# Altium project Peggy Tracker.PrjPcb
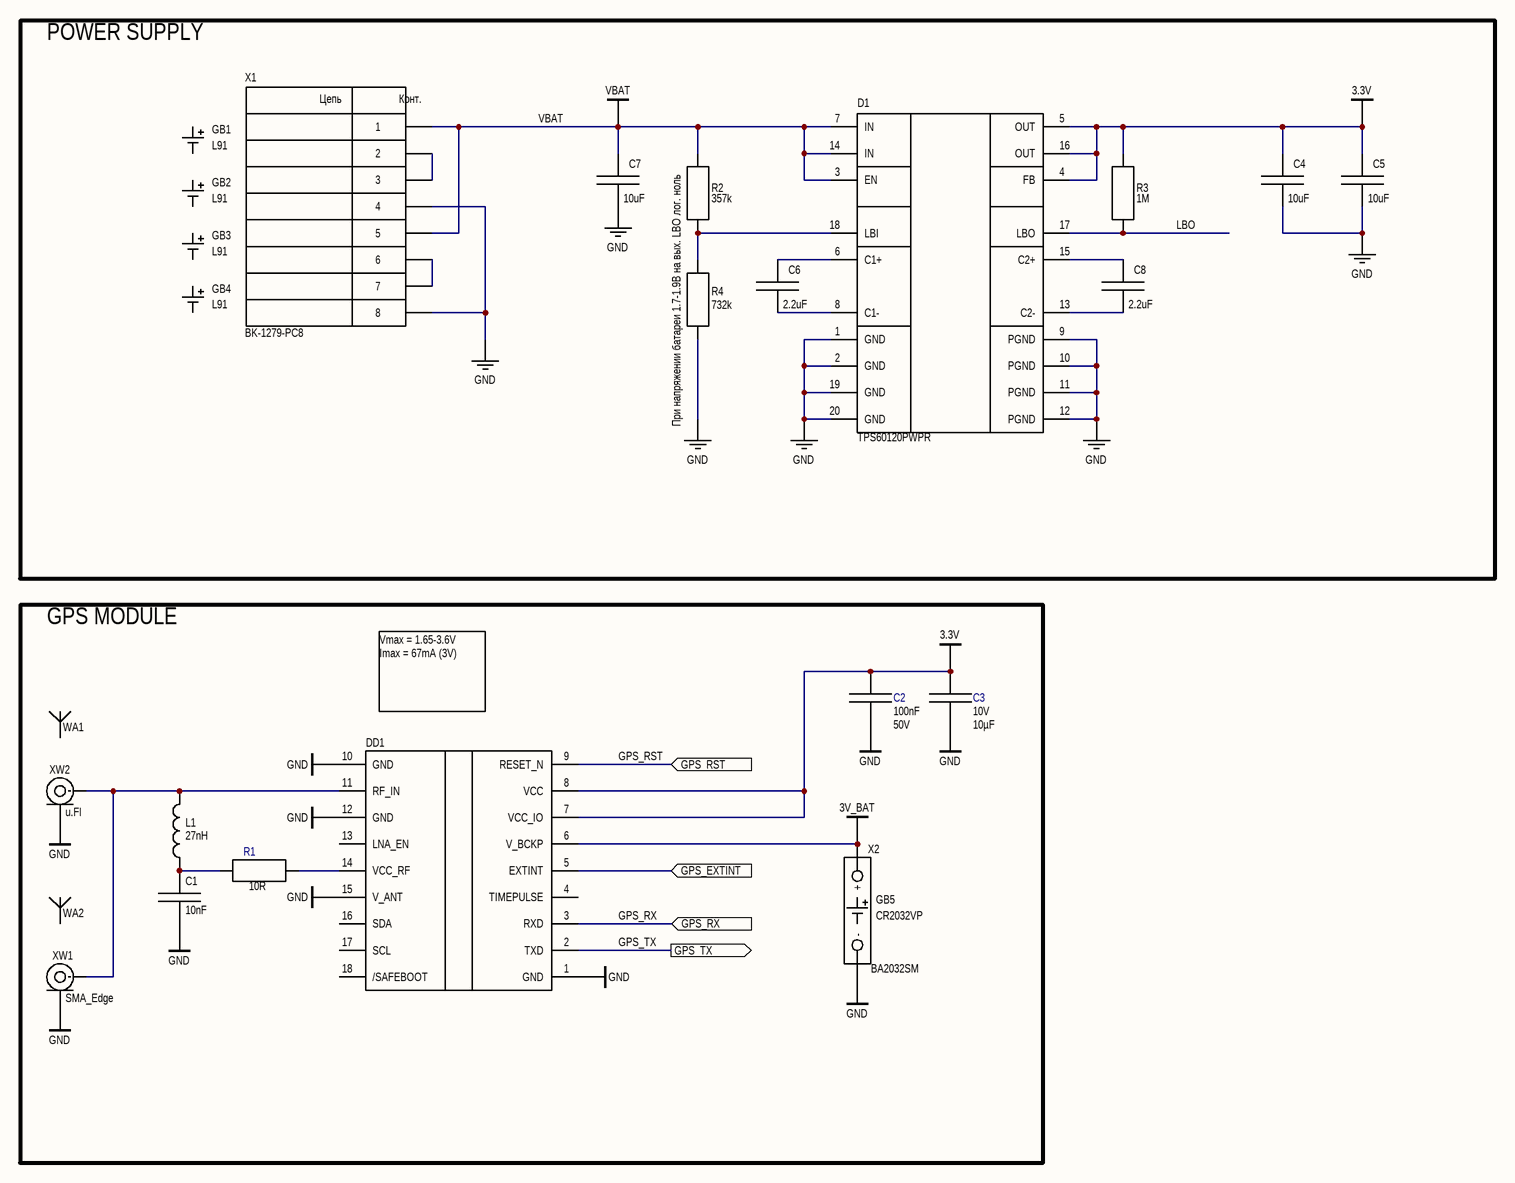
[diagram p0: Схема питания и GPS Peggy Tracker.SchDoc]
CAGE_CODE: ?????; CONTRACT_NUMBER: <CONTRACT NO>; DOC_NO_ASSY_DWG: <ASSY DWG NO>; DOC_NO_BOM: <BOM DOC NO>; DOC_NO_FAB_DWG: <FAB DWG NO>; DOC_NO_SCH_DWG: <SCH DWG NO>; PCB_2_DEC_TOL: +/-.01; PCB_3_DEC_TOL: +/-.010; PCB_ANG_TOL: +/-1/2; PCB_ASSEMBLY_NO: <PCB ASSY NO>; PCB_CHECKER: - -----; PCB_CHECKER_APP_DATE: --/--/----; PCB_DESIGNER: - -----; PCB_DESIGNER_APP_DATE: --/--/----; PCB_DWG_NO: <PCB DWG NO>; PCB_ENGINEER: - -----; PCB_ENGINEER_APP_DATE: --/--/----; PCB_PART_NUMBER: <PCB PN>; PCB_REV: A; SCH_REV: A
2 sheets, 64 parts. Net scope: flat (ports and power ports of the same name join across sheets).
Board file: Печатная плата Peggy Tracker.PcbDoc
Sheets:
  Схема питания и GPS Peggy Tracker.SchDoc
  Схема блока МК Peggy Tracker.SchDoc

## Sheet Схема питания и GPS Peggy Tracker.SchDoc
size 420 x 297 mm; ENG_APP_DATE: --/--/--; DSN_APP_DATE: --/--/--; CHK_APP_DATE: --/--/--; Scale: 1:1; Разраб.: Иванов; Обозначение документа: АБВГ.123456.001 Э3; Пров.: Петров; Утв.: Сидоров; Наименование организации: ОАО "Ваша фирма"; Перв. применение: АБВГ.123456.000; Наименование изделия 1: Плата; Наименование изделия 2: Схема электрическая; Наименование изделия 3: принципиальная; Нач. отд.: Нач. отд.; Фамилия нач. отд.: Сидоров

### Parts
C1  10nF  [CH0603C]
C2  value 100nF  Voltage Rating: 50V  [CAPC1608X09N]  (hidden comment: GCM188R71H104KA57D)
C3  Voltage Rating: 10V  Capacitance: 10µF  [CAPC2013X135X45NL10T25]  (hidden comment: CL21Y106KPQVPNE)
C4  10uF  [CH1206C]
C5  10uF  [CH1206C]
C6  2.2uF  [CH0805C]
C7  10uF  [CH1206C]
C8  2.2uF  [CH0805C]
D1  TPS60120PWPR  [20-TSSOP (PAD)]
DD1  MAX-M8C-0  [MOD: MAX-M8C-0]  (value not drawn)
GB1  L91
GB2  L91
GB3  L91
GB4  L91
GB5  CR2032VP
L1  27nH  [CH0603L]
R1  10R  [CH0603R]
R2  357k  [CH0603R]
R3  1M  [CH0603R]
R4  732k  [CH0603R]
WA1  CRJKS0010-LNA-G65U  (value not drawn)
WA2  MIKE3A/3M/SMAM/S/S/17  (value not drawn)
X1  BK-1279-PC8  [CON: BK-1279-PC8]
X2  BA2032SM  [CON: BA2032SM]
XW1  SMA_Edge  [CON: SMA - Edge]
XW2  u.Fl  [CON: u.Fl]

### Blocks framed on the sheet
POWER SUPPLY: C4-C8 D1 GB1-GB4 R2-R4 X1
GPS MODULE: C1-C3 DD1 GB5 L1 R1 WA1 WA2 X2 XW1 XW2

### Ports
GPS_EXTINT (in), GPS_RST (in), GPS_RX (in), GPS_TX (out)

### Nets
3.3V: C2.1 C3.2 C4.1 C5.1 D1.4(FB) D1.5(OUT) D1.16(OUT) DD1.7(VCC_IO) DD1.8(VCC) R3.2
3V_BAT: DD1.6(V_BCKP) X2.1(+)
GND: C1.2 C2.2 C3.1 C4.2 C5.2 C7.2 D1.1(GND) D1.2(GND) D1.9(PGND) D1.10(PGND) D1.11(PGND) D1.12(PGND) D1.19(GND) D1.20(GND) DD1.1(GND) DD1.10(GND) DD1.12(GND) DD1.15(V_ANT) R4.1 X1.4 X1.8 X2.2(-) XW1.2(IN) XW2.2(IN)
VBAT: C7.1 D1.3(EN) D1.7(IN) D1.14(IN) R2.2 X1.1 X1.5
GPS_RST: DD1.9(RESET_N) ; port GPS_RST
GPS_RX: DD1.3(RXD) ; port GPS_RX
GPS_TX: DD1.2(TXD) ; port GPS_TX
LBO: D1.17(LBO) R3.1
NetC1_1: C1.1 L1.1 R1.1
NetC6_1: C6.1 D1.6(C1+)
NetC6_2: C6.2 D1.8(C1-)
NetC8_1: C8.1 D1.15(C2+)
NetC8_2: C8.2 D1.13(C2-)
NetD1_18: D1.18(LBI) R2.1 R4.2
NetDD1_5: DD1.5(EXTINT) ; port GPS_EXTINT
NetDD1_11: DD1.11(RF_IN) L1.2 XW1.1(IN) XW2.1(IN)
NetDD1_14: DD1.14(VCC_RF) R1.2
NetX1_2: X1.2 X1.3
NetX1_6: X1.6 X1.7

Not connected (* = marked no-connect by the designer): DD1 4(TIMEPULSE) 13(LNA_EN) 16(SDA) 17(SCL) 18(/SAFEBOOT); GB1 1(+) 2(-); GB2 1(+) 2(-); GB3 1(+) 2(-); GB4 1(+) 2(-); GB5 1(+) 2(-); WA1 1; WA2 1

### Notes on the sheet
- При напряжении батареи 1.7-1.9В на вых. LBO лог. ноль
- (near DD1) Vmax = 1.65-3.6V
  Imax = 67mA (3V)
- Перв. примен.
- Справ. №
- Подп. и дата
- Инв. № дубл.
- Взам. инв. №
- Разраб.
- Изм.
- Лист
- № докум.
- Подп.
- Дата
- Лит.
- Масса
- Масштаб
- Пров.
- Т.контр.
- Листов
- Инв. № подл.
- Утв.
- Н.контр.
- Копировал
- Формат А3
- (in symbol 8-Connector) Цепь; Конт.

### Library data of the parts
C1 = Capacitor: CAP CER 10000PF 50V X7R 0603; Manufacturer: Murata Electronics; Model: GCM188R71H103KA37D; HelpURL: https://www.digikey.com/en/products/detail/murata-electronics/GCM188R71H103KA37D/1641652?s=N4IgTCBcDaIOIGECyBGAHGgSgdhQCRQAYBmAaQEFjsAREAXQF8g; ComponentKind: 0603 (1608 Metric); Value: 10nF; Supplier 1: Digi-Key; Supplier Part Number 1: 490-4778-1-ND
C2 = CMP-001-00128-5: CAP CER 0.1UF 50V X7R 0603; Manufacturer: Murata; Tolerance: 10%; Approvals: CSA,UR; Color: Grey; RoHS Compliant: Yes; Case/Package: 0603; Max Operating Temperature: 125°C; Min Operating Temperature: -55°C; Case Code (Metric): 1608; Depth: 0.8mm; Dielectric: X7R; Height: 0.8mm; Length: 1.6mm; Mount: Surface Mount; Package Quantity: 1; Packaging: Tape and Reel; Radiation Hardening: No; Series: GCM; Termination: SMD/SMT; Thickness: 0.035inch; Width: 0.031inch; Manufacturer Part Number: GCM188R71H104KA57D; Lead Free: Lead Free; REACH SVHC: No SVHC; Voltage: 50V; ComponentLink1Description: https://datasheet.ciiva.com/16624/product-16624562.pdf?src-supplier=Avnet+Europe; ComponentLink1URL: https://datasheet.ciiva.com/16624/product-16624562.pdf?src-supplier=Avnet+Europe; ComponentLink2Description: https://datasheet.ciiva.com/133/product-133574.pdf?src-supplier=Digi-Key; ComponentLink2URL: https://datasheet.ciiva.com/133/product-133574.pdf?src-supplier=Digi-Key; ComponentLink3Description: https://datasheet.ciiva.com/133/product-133575.pdf?src-supplier=Digi-Key; ComponentLink3URL: https://datasheet.ciiva.com/133/product-133575.pdf?src-supplier=Digi-Key; ComponentLink4Description: https://datasheet.ciiva.com/18183/getdatasheetpartid-98693-18183626.pdf?src-supplier=Verical; ComponentLink4URL: https://datasheet.ciiva.com/18183/getdatasheetpartid-98693-18183626.pdf?src-supplier=Verical; ComponentLink5Description: https://datasheet.ciiva.com/11786/0900766b80ef92d0-11786863.pdf?src-supplier=RSComponents; ComponentLink5URL: https://datasheet.ciiva.com/11786/0900766b80ef92d0-11786863.pdf?src-supplier=RSComponents; ComponentLink6Description: https://datasheet.ciiva.com/133/product-133573.pdf?src-supplier=Digi-Key; ComponentLink6URL: https://datasheet.ciiva.com/133/product-133573.pdf?src-supplier=Digi-Key; ComponentLink7Description: https://datasheet.ciiva.com/2989/product-2989242.pdf?src-supplier=Avnet; ComponentLink7URL: https://datasheet.ciiva.com/2989/product-2989242.pdf?src-supplier=Avnet; ComponentLink8Description: https://datasheet.ciiva.com/16497/product-16497247.pdf?src-supplier=Future+Electronics; ComponentLink8URL: https://datasheet.ciiva.com/16497/product-16497247.pdf?src-supplier=Future+Electronics; Construction: Flat; Design Item ID: 1_16; Pricing 1: 1=0,11000, 10=0,07900, 50=0,04280, 100=0,03500, 500=0,02502, 1000=0,01966 (USD); Ratings: AEC-Q200; RoHS: Yes; Source: Meteo_1.SCHLIB; Stock 1: 4755830; Voltage Rating (DC): 50V
C3 = CMP-001-00143-4: CAP CER 10UF 10V X7S 0805; Manufacturer: Samsung; Value: 10µF; Tolerance: 10%; Manufacturer Part Number: CL21Y106KPQVPNE; Packaging: Tape and Reel; Max Operating Temperature: 125°C; RoHS Compliant: Yes; Case/Package: 0805; Features: Soft Termination; Case Code (Imperial): 0805; Thickness: 0.055inch; Length: 0.079inch; Min Operating Temperature: -55°C; Width: 0.049inch; Ratings: AEC-Q200; Mount: Surface Mount; Case Code (Metric): 2012; Lead Free: Lead Free
C4 C5 C7 = Capacitor: Cap Ceramic 10uF 16V X7R 20% SMD 1206 125°C Embossed T/R; Manufacturer: Samsung Electro-Mechanics; Model: CL31B106MOHNNNE; HelpURL: https://www.digikey.com/en/products/detail/samsung-electro-mechanics/CL31B106MOHNNNE/5961125; ComponentKind: 1206 (3216 Metric); Value: 10uF; Supplier 1: Digi-Key; Supplier Part Number 1: 1276-6641-1-ND; Manufacturer Part Number: CL31B106MOHNNNE; RoHS: Yes; Category: Ceramic Capacitors; Stock: 1126; Pricing: 1=0,22000, 10=0,15000, 50=0,09000, 100=0,07600, 500=0,05202, 1000=0,04602 (USD); Mount: Surface Mount; Case/Package: 1206; Case Code (Metric): 3216; Case Code (Imperial): 1206; Min Operating Temperature: -55°C; Max Operating Temperature: 125°C; Capacitance: 10uF; Tolerance: 20%; Dielectric: X7R; Voltage Rating (DC): 16V; Packaging: Tape and Reel; Voltage Rating: 16V; Length: 0.126inch; Width: 0.063inch; Thickness: 0.071inch; RoHS Compliant: Yes; ComponentLink1URL: http://www.samsungsem.com/kr/support/product-search/mlcc/CL31B106MOHNNNE.jsp?src-supplier=Digi-Key; ComponentLink1Description: http://www.samsungsem.com/kr/support/product-search/mlcc/CL31B106MOHNNNE.jsp?src-supplier=Digi-Key
C6 C8 = Capacitor: Cap Ceramic 10uF 16V X7R 20% SMD 1206 125°C Embossed T/R; Manufacturer: Murata Electronics; Manufacturer Part Number: CL31B106MOHNNNE; Model: GRM21BR71E225KE11L; Voltage Rating: 25V; HelpURL: https://www.digikey.com/en/products/detail/murata-electronics/GRM21BR71E225KE11L/6606096; ComponentKind: 0805 (2012 Metric); Value: 2.2uF; RoHS: Yes; Category: Ceramic Capacitors; Stock: 1126; Pricing: 1=0,22000, 10=0,15000, 50=0,09000, 100=0,07600, 500=0,05202, 1000=0,04602 (USD); Mount: Surface Mount; Case/Package: 0805; Case Code (Metric): 3216; Min Operating Temperature: -55°C; Max Operating Temperature: 125°C; Capacitance: 2.2uF; Tolerance: 20%; Dielectric: X7R; Voltage Rating (DC): 16V; Packaging: Tape and Reel; Length: 0.126inch; Width: 0.063inch; Thickness: 0.071inch; RoHS Compliant: Yes; ComponentLink1URL: http://www.samsungsem.com/kr/support/product-search/mlcc/CL31B106MOHNNNE.jsp?src-supplier=Digi-Key; ComponentLink1Description: http://www.samsungsem.com/kr/support/product-search/mlcc/CL31B106MOHNNNE.jsp?src-supplier=Digi-Key; Supplier 1: Digi-Key; Supplier Part Number 1: 490-14467-1-ND
D1 = TPS60120PWPR: Charge Pump Switching Regulator 3.3V; Manufacturer: Texas Instruments; Model: TPS60120PWPR; HelpURL: https://www.digikey.com/en/products/detail/texas-instruments/TPS60120PWPR/1671965; ComponentKind: PowerTSSOP; Supplier 1: Digi-Key; Supplier Part Number 1: 296-48756-1-ND
DD1 = MAX-M8C-0: RF RCVR GNSS/GPS 1.575GHZ 18LCC; Manufacturer: U-Blox; Model: MAX-M8C-0; ComponentKind: Surface Mount; HelpURL: https://www.digikey.com/en/products/detail/u-blox/MAX-M8C-0/6150635?s=N4IgTCBcDaILIEEAaBaOAOAwigDCAugL5A; Supplier 1: Digi-Key; Supplier Part Number 1: 672-MAX-M8C-0CT-ND
GB1-GB5 = Battery_1CELL: Manufacturer: Energizer Battery Company; Supplier 1: Digi-Key
  GB1-GB4: Model: L91; HelpURL: https://www.digikey.com/en/products/detail/energizer-battery-company/L91/704843?s=N4IgjCBcpgnAHLKoDGUBmBDANgZwKYA0IA9lANogAMIAugL7EC0ATMiGpAC4BOArkVIUQAVjr1GINpEoAZWGAAEAUQB2%2BHgHMAlgC8NisADoRANTrEx0EAAcoYYjbuQwVKhKA; ComponentKind: AA; Supplier Part Number 1: N602-ND
  GB5: Model: CR2032VP; HelpURL: https://www.digikey.com/en/products/detail/energizer-battery-company/CR2032VP/704858?s=N4IgTCBcDaIMICUwAYDMYBqAFEBdAvkA; ComponentKind: Coin, 20.0mm; Supplier Part Number 1: N189-ND
L1 = Inductor: Manufacturer: Murata Electronics; Model: LQW18AN27NJ00D; HelpURL: https://www.digikey.com/en/products/detail/murata-electronics/LQW18AN27NJ00D/584382?s=N4IgTCBcDaIDIEUDqBGAHAQQHJgOxYCkAGIgERAF0BfIA; ComponentKind: 0603 (1608 Metric); Value: 27nH; Supplier 1: Digi-Key; Supplier Part Number 1: 490-1174-1-ND
R1 = Resistor: RES 10 OHM 5% 1/3W 0603; Manufacturer: KOA Speer Electronics, Inc.; Model: SG73P1JTTD100J; HelpURL: https://www.digikey.com/en/products/detail/koa-speer-electronics-inc/SG73P1JTTD100J/10187128?s=N4IgTCBcDaIMoHEDsBmACgRgFIBUcBEMAGIrEAXQF8g; ComponentKind: 0603 (1608 Metric); Value: 10R; Supplier 1: Digi-Key; Supplier Part Number 1: 2019-SG73P1JTTD100JCT-ND
R2 = Resistor: Manufacturer: YAGEO; Model: RC0603FR-07357KL; HelpURL: https://www.digikey.com/en/products/detail/yageo/RC0603FR-07357KL/727177*; ComponentKind: 0603 (1608 Metric); Value: 357k; Supplier 1: Digi-Key; Supplier Part Number 1: 311-357KHRCT-ND
R3 = Resistor: Manufacturer: YAGEO; Model: RC0603FR-071ML; HelpURL: https://www.digikey.com/en/products/detail/yageo/RC0603FR-071ML/726844; ComponentKind: 0603 (1608 Metric); Value: 1M; Supplier 1: Digi-Key; Supplier Part Number 1: 311-1.00MHRCT-ND
R4 = Resistor: Manufacturer: YAGEO; Model: RC0603FR-07732KL; HelpURL: https://www.digikey.com/en/products/detail/yageo/RC0603FR-07732KL/727376; ComponentKind: 0603 (1608 Metric); Value: 732k; Supplier 1: Digi-Key; Supplier Part Number 1: 311-732KHRCT-ND
WA1 = Antenna 1pin: 1.583GHz GPS Ceramic Patch RF Antenna 1.559GHz ~ 1.610GHz 17dBi - -; Manufacturer: NimbeLink, LLC; Model: CRJKS0010-LNA-G65U; HelpURL: https://www.digikey.com/en/products/detail/nimbelink-llc/CRJKS0010-LNA-G65U/15519589; ComponentKind: *; Supplier 1: Digi-Key; Supplier Part Number 1: 1477-CRJKS0010-LNA-G65U-ND
WA2 = Antenna 1pin: 1.575GHz GPS Module RF Antenna - 28dB SMA Male Adhesive, Magnetic; Manufacturer: Siretta Ltd; Model: MIKE3A/3M/SMAM/S/S/17; HelpURL: https://www.digikey.com/en/products/detail/siretta-ltd/MIKE3A-3M-SMAM-S-S-17/6096367; ComponentKind: SMA Male; Supplier 1: Digi-Key; Supplier Part Number 1: MIKE3A/3M/SMAM/S/S/17-ND
X1 = 8-Connector: BATTERY HOLDER AA 4 CELL PC PIN; Manufacturer: MPD (Memory Protection Devices); Model: BK-1279-PC8; HelpURL: https://www.digikey.com/en/products/detail/mpd-memory-protection-devices/BK-1279-PC8/1640077; ComponentKind: PC Pin; Supplier 1: Digi-Key; Supplier Part Number 1: BK-1279-PC8-ND
X2 = Holder_1Cell: Manufacturer: MPD (Memory Protection Devices); Model: BA2032SM; HelpURL: https://www.digikey.com/en/products/detail/mpd-memory-protection-devices/BA2032SM/257743?s=N4IgTCBcDaIEIEEwAYDMYDKBZEBdAvkA; ComponentKind: 20.0mm 1 Cell SMD (SMT) Tab; Supplier 1: Digi-Key; Supplier Part Number 1: BA2032-ND
XW1 = SMA: RF; Manufacturer: Molex; Model: 0732512120; HelpURL: https://www.digikey.com/en/products/detail/molex/0732512120/1465158?s=N4IgTCBcDaIOwGYwFYCMBaMqwAYQF0BfIA; ComponentKind: Board Edge; Supplier 1: Digi-Key; Supplier Part Number 1: WM5536-ND
XW2 = u.Fl: RF; Manufacturer: Hirose Electric Co Ltd; Model: CONUFL001-SMD-T; HelpURL: https://www.digikey.com/en/products/detail/linx-technologies-inc/CONUFL001-SMD-T/7427732?s=N4IgTCBcDaIMIHkByBVAYgGQAxYIwFoBlAWQBF8AVEAXQF8g; ComponentKind: Surface Mount Solder; Supplier 1: Digi-Key; Supplier Part Number 1: CONUFL001-SMD-TCT-ND

## Sheet Схема блока МК Peggy Tracker.SchDoc
size 420 x 297 mm; Address1: Address1; Address2: Address2; Address3: Address3; Address4: Address4; SheetNumber: 1; Scale: 1:1; Обозначение документа: АБВГ.123456.001 Э3
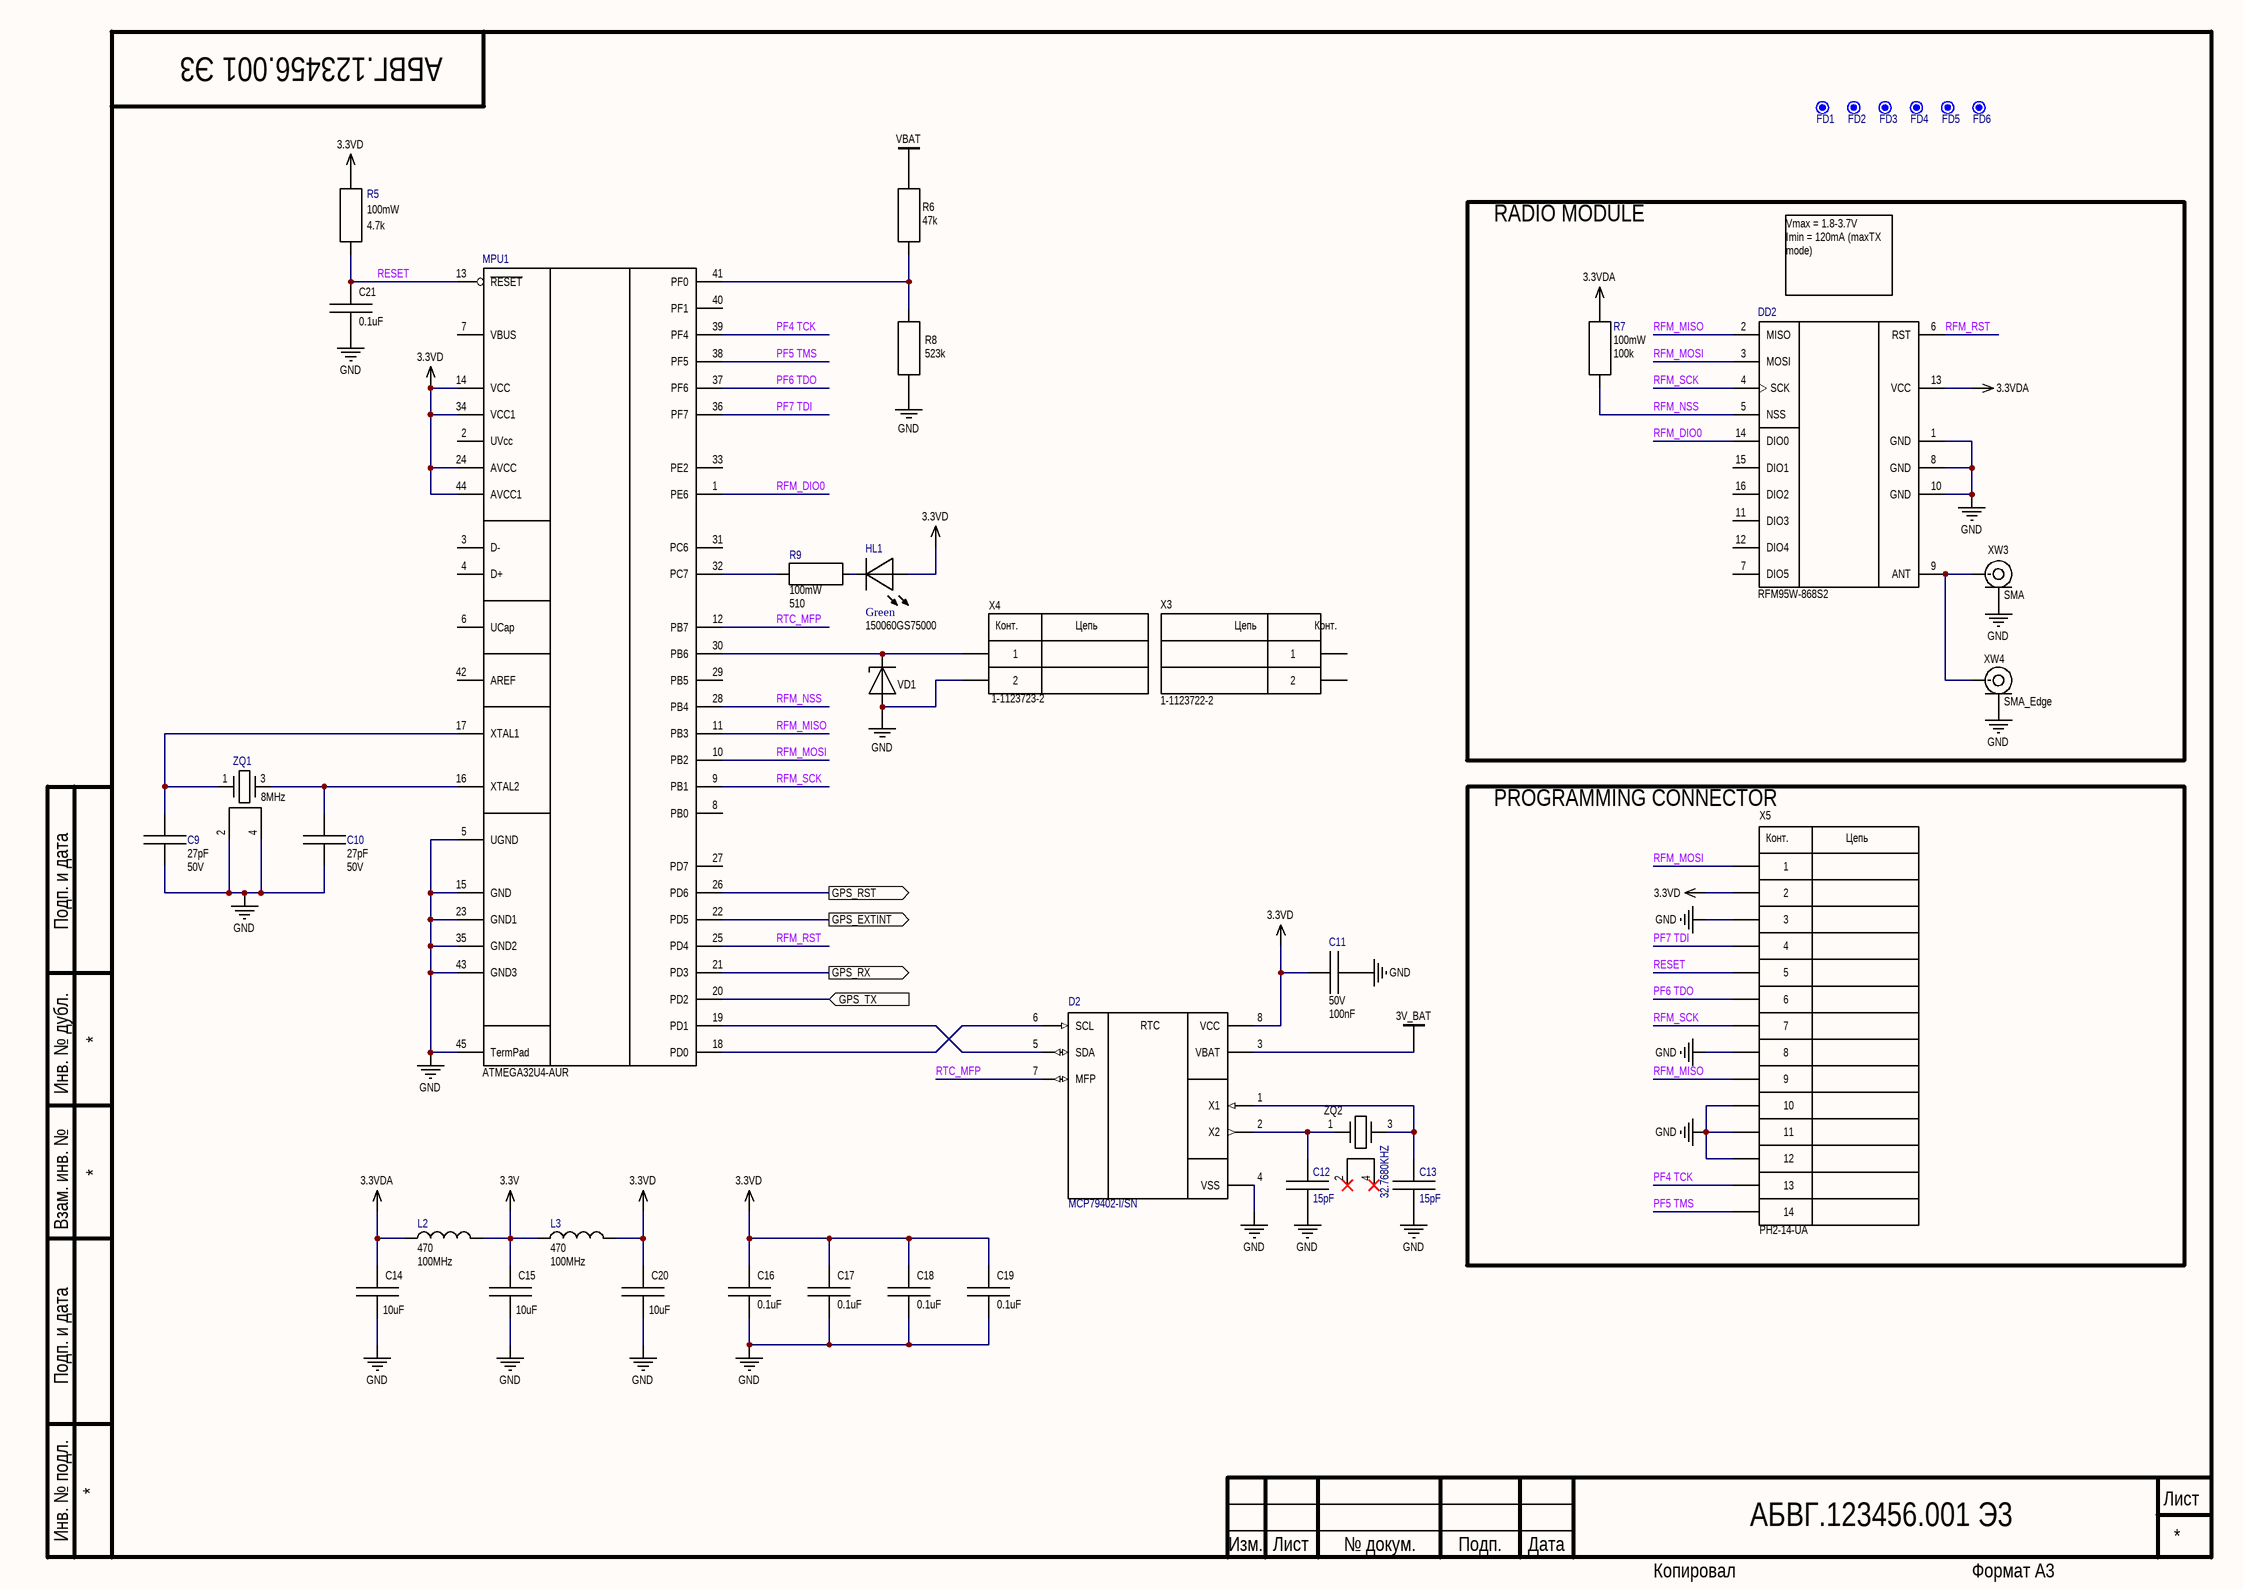
[diagram p1: Схема блока МК Peggy Tracker.SchDoc]

### Parts
C9  Capacitance: 27pF  Voltage Rating: 50V  [CAPC1608X87X35NL15T15]  (hidden comment: CC0603JPNPO9BN270)
C10  Capacitance: 27pF  Voltage Rating: 50V  [CAPC1608X87X35NL15T15]  (hidden comment: CC0603JPNPO9BN270)
C11  value 100nF  Voltage Rating: 50V  [CAPC1608X09N]  (hidden comment: GCM188R71H104KA57D)
C12  15pF  [CH0603C]
C13  15pF  [CH0603C]
C14  10uF  [CH1206C]
C15  10uF  [CH1206C]
C16  0.1uF  [CH0603C]
C17  0.1uF  [CH0603C]
C18  0.1uF  [CH0603C]
C19  0.1uF  [CH0603C]
C20  10uF  [CH1206C]
C21  0.1uF  [CH0603C]
D2  MCP79402-I/SN  [8-SOIC]
DD2  RFM95W-868S2  [RFM95W-868S2]
FD1  FID1X2R  [FID1X2R]  (value not drawn)  (no BOM)
FD2  FID1X2R  [FID1X2R]  (value not drawn)  (no BOM)
FD3  FID1X2R  [FID1X2R]  (value not drawn)  (no BOM)
FD4  FID1X2R  [FID1X2R]  (value not drawn)  (no BOM)
FD5  FID1X2R  [FID1X2R]  (value not drawn)  (no BOM)
FD6  FID1X2R  [FID1X2R]  (value not drawn)  (no BOM)
HL1  Color: Green  [CH0603LG]  (hidden comment: 150060GS75000)
L2  Impedance: 470  Test Frequency: 100MHz  [MH2029-471Y-Footprint-1]  (hidden comment: MH2029-471Y)
L3  Impedance: 470  Test Frequency: 100MHz  [MH2029-471Y-Footprint-1]  (hidden comment: MH2029-471Y)
MPU1  Manufacturer Part Number: ATMEGA32U4-AUR  [ATMEGA32U4-MU]  (hidden comment: ATMEGA32U4-AU)
R5  Power Rating: 100mW  Resistance: 4.7k  [CH0603R]  (hidden comment: RMCF0603FT4K70)
R6  47k  [CH0603R]
R7  value 100k  Power: 100mW  [RESC1608X55X25NL10T15]  (hidden comment: Resistor 100k +/-1% 0603 100 mW)
R8  523k  [CH0603R]
R9  Power Rating: 100mW  Resistance: 510  [RESC1608X55X25NL10T15]  (hidden comment: RMCF0603JT510R)
VD1  DESD3V3S1BL-7B  [X1-DFN1006-2 (0402 )]  (value not drawn)
X3  1-1123722-2  [CON: 1-1123723-2]
X4  1-1123723-2  [CON: 1-1123723-2]
X5  PH2-14-UA  [CON: PLD-14]
XW3  SMA  [CON: SMA]
XW4  SMA_Edge  [CON: SMA - Edge]
ZQ1  Frequency: 8MHz  [FY0800018-Footprint-1]  (hidden comment: FY0800018)
ZQ2  32.7680KHZ  [OSC: 3215]

### Blocks framed on the sheet
RADIO MODULE: DD2 R7 XW3 XW4
PROGRAMMING CONNECTOR: X5

### Ports
GPS_EXTINT (out), GPS_RST (out), GPS_RX (out), GPS_TX (in)

### Nets
3.3V: C15.1 L2.2 L3.1
3.3VD: C11.2 C16.1 C17.1 C18.1 C19.1 C20.1 D2.8(VCC) HL1.2 L3.2 MPU1.14(VCC) MPU1.24(AVCC) MPU1.34(VCC1) MPU1.44(AVCC1) R5.2 X5.2
3.3VDA: C14.1 DD2.13(VCC) L2.1 R7.2
3V_BAT: D2.3(VBAT)
GND: C9.1 C10.1 C11.1 C12.2 C13.2 C14.2 C15.2 C16.2 C17.2 C18.2 C19.2 C20.2 C21.2 D2.4(VSS) DD2.1(GND) DD2.8(GND) DD2.10(GND) MPU1.5(UGND) MPU1.15(GND) MPU1.23(GND1) MPU1.35(GND2) MPU1.43(GND3) MPU1.45(TermPad) R8.1 VD1.1(A) X4.2 X5.3 X5.8 X5.10 X5.11 X5.12 XW3.2(IN) XW4.2(IN) ZQ1.2 ZQ1.4
VBAT: R6.2
GPS_RST: MPU1.26(PD6) ; port GPS_RST
GPS_RX: MPU1.21(PD3) ; port GPS_RX
GPS_TX: MPU1.20(PD2) ; port GPS_TX
PF4 TCK: MPU1.39(PF4) X5.13
PF5 TMS: MPU1.38(PF5) X5.14
PF6 TDO: MPU1.37(PF6) X5.6
PF7 TDI: MPU1.36(PF7) X5.4
RESET: C21.1 MPU1.13(~{RESET}) R5.1 X5.5
RFM_DIO0: DD2.14(DIO0) MPU1.1(PE6)
RFM_MISO: DD2.2(MISO) MPU1.11(PB3) X5.9
RFM_MOSI: DD2.3(MOSI) MPU1.10(PB2) X5.1
RFM_NSS: DD2.5(NSS) MPU1.28(PB4) R7.1
RFM_RST: DD2.6(RST) MPU1.25(PD4)
RFM_SCK: DD2.4(SCK) MPU1.9(PB1) X5.7
RTC_MFP: D2.7(MFP) MPU1.12(PB7)
NetC9_2: C9.2 MPU1.17(XTAL1) ZQ1.1
NetC10_2: C10.2 MPU1.16(XTAL2) ZQ1.3
NetC12_1: C12.1 D2.2(X2) ZQ2.1
NetC13_1: C13.1 D2.1(X1) ZQ2.3
NetD2_5: D2.5(SDA) MPU1.19(PD1)
NetD2_6: D2.6(SCL) MPU1.18(PD0)
NetDD1_5: MPU1.22(PD5) ; port GPS_EXTINT
NetDD2_9: DD2.9(ANT) XW3.1(IN) XW4.1(IN)
NetHL1_1: HL1.1 R9.2
NetMPU1_30: MPU1.30(PB6) VD1.2(C) X4.1
NetMPU1_32: MPU1.32(PC7) R9.1
NetMPU1_41: MPU1.41(PF0) R6.1 R8.2

Not connected (* = marked no-connect by the designer): DD2 7(DIO5) 11(DIO3) 12(DIO4) 15(DIO1) 16(DIO2); MPU1 2(UVcc) 3(D-) 4(D+) 6(UCap) 7(VBUS) 8(PB0) 27(PD7) 29(PB5) 31(PC6) 33(PE2) 40(PF1) 42(AREF); X3 1 2; ZQ2 2* 4*

### Notes on the sheet
- (near DD2) Vmax = 1.8-3.7V
  Imin = 120mA (maxTX mode)
- Подп. и дата
- Инв. № дубл.
- Взам. инв. №
- Инв. № подл.
- Изм.
- Лист
- № докум.
- Подп.
- Дата
- Копировал
- Формат А3
- (in symbol 2-Connector) Конт.; Цепь
- (in symbol 14-Connector) Конт.; Цепь

### Library data of the parts
C9 C10 = CMP-009-00292-1: 0603 50V C0G 27pF 5% multilayer ceramic capacitor; Manufacturer: YAGEO; Length: 1.6mm; Package Quantity: 15000; Depth: 0.8mm; RoHS Compliant: Yes; Pins: 2; Case Code (Metric): 1608; Dielectric: C0G; Packaging: Tape and Reel; Series: NP0; Max Operating Temperature: 125°C; Case Code (Imperial): 0603; Case/Package: 0603; Tolerance: 5%; Termination: SMD/SMT; Min Operating Temperature: -55°C; Manufacturer Part Number: CC0603JPNPO9BN270
C11 = CMP-001-00128-6: CAP CER 0.1UF 50V X7R 0603; Manufacturer: Murata; Tolerance: 10%; Color: Grey; Approvals: CSA,UR; Capacitance: 100nF; ComponentLink2URL: https://datasheet.ciiva.com/133/product-133574.pdf?src-supplier=Digi-Key; Source: Meteo_1.SCHLIB; Ratings: AEC-Q200; Case/Package: 0603; Package Quantity: 1; ComponentLink8URL: https://datasheet.ciiva.com/16497/product-16497247.pdf?src-supplier=Future+Electronics; Voltage Rating (DC): 50V; ComponentLink5URL: https://datasheet.ciiva.com/11786/0900766b80ef92d0-11786863.pdf?src-supplier=RSComponents; Stock 1: 4755830; Pricing 1: 1=0,11000, 10=0,07900, 50=0,04280, 100=0,03500, 500=0,02502, 1000=0,01966 (USD); Thickness: 0.035inch; ComponentLink4URL: https://datasheet.ciiva.com/18183/getdatasheetpartid-98693-18183626.pdf?src-supplier=Verical; Packaging: Tape and Reel; ComponentLink7Description: https://datasheet.ciiva.com/2989/product-2989242.pdf?src-supplier=Avnet; Construction: Flat; REACH SVHC: No SVHC; ComponentLink3Description: https://datasheet.ciiva.com/133/product-133575.pdf?src-supplier=Digi-Key; Case Code (Metric): 1608; ComponentLink1Description: https://datasheet.ciiva.com/16624/product-16624562.pdf?src-supplier=Avnet+Europe; Height: 0.8mm; Termination: SMD/SMT; ComponentLink8Description: https://datasheet.ciiva.com/16497/product-16497247.pdf?src-supplier=Future+Electronics; Design Item ID: 1_16; Length: 1.6mm; ComponentLink6Description: https://datasheet.ciiva.com/133/product-133573.pdf?src-supplier=Digi-Key; ComponentLink3URL: https://datasheet.ciiva.com/133/product-133575.pdf?src-supplier=Digi-Key; RoHS: Yes; Min Operating Temperature: -55°C; Depth: 0.8mm; Manufacturer Part Number: GCM188R71H104KA57D; ComponentLink2Description: https://datasheet.ciiva.com/133/product-133574.pdf?src-supplier=Digi-Key; Series: GCM; Mount: Surface Mount; ComponentLink7URL: https://datasheet.ciiva.com/2989/product-2989242.pdf?src-supplier=Avnet; ComponentLink4Description: https://datasheet.ciiva.com/18183/getdatasheetpartid-98693-18183626.pdf?src-supplier=Verical; ComponentLink6URL: https://datasheet.ciiva.com/133/product-133573.pdf?src-supplier=Digi-Key; Voltage: 50V; RoHS Compliant: Yes; Dielectric: X7R; Max Operating Temperature: 125°C; Radiation Hardening: No; ComponentLink1URL: https://datasheet.ciiva.com/16624/product-16624562.pdf?src-supplier=Avnet+Europe; Lead Free: Lead Free; ComponentLink5Description: https://datasheet.ciiva.com/11786/0900766b80ef92d0-11786863.pdf?src-supplier=RSComponents; Width: 0.031inch
C12 C13 = Capacitor: CAP CER 15PF 50V C0G/NPO 0603; Manufacturer: YAGEO; Model: CC0603JRNPO9BN150; HelpURL: https://www.digikey.com/en/products/detail/yageo/CC0603JRNPO9BN150/302794; ComponentKind: 0603 (1608 Metric); Value: 15pF; Supplier 1: Digi-Key; Supplier Part Number 1: 311-1060-1-ND
C14 C15 C20 = Capacitor: CAP CER 10UF 16V X7R 1206; Manufacturer: Murata Electronics; Model: GCM31CR71C106KA64K; HelpURL: https://www.digikey.com/en/products/detail/murata-electronics/GCM31CR71C106KA64K/2592432?s=N4IgTCBcDaIOIGECyBmAjAgSgdg2gDAGwDSAgoQCzEgC6AvkA; ComponentKind: 1206 (3216 Metric); Value: 10uF; Supplier 1: Digi-Key; Supplier Part Number 1: 490-14746-1-ND
C16-C19 C21 = Capacitor: Manufacturer: Murata Electronics; Model: GCM188R71H104KA57D; HelpURL: https://www.digikey.com/en/products/detail/murata-electronics/GCM188R71H104KA57D/1641653?s=N4IgTCBcDaIOIGECyBGAHGgSgdhQCRQAYAWAaQEEBWbAERAF0BfIA; ComponentKind: 0603 (1608 Metric); Value: 0.1uF; Supplier 1: Digi-Key; Supplier Part Number 1: 490-4779-1-ND
D2 = MCP7940M-I/SN: RTC; Manufacturer: Microchip Technology; Model: MCP7940M-I/SN; HelpURL: https://www.digikey.com/en/products/detail/microchip-technology/MCP79402-I-SN/2712447; ComponentKind: 8-SOIC; Supplier 1: Digi-Key; Supplier Part Number 1: MCP79402-I/SN-ND
DD2 = CMP-032-0024-3: RF TXRX MODULE ISM<1GHZ; Manufacturer: RF Solutions; Data Rate: 300Kbps; Sensitivity: -123dBm; Current - Receiving: 12.1mA; Interface: SPI; Current - Transmitting: 120mA; Frequency: 868MHz; Max Operating Temperature: 70°C; Case/Package: SMD/SMT; Mount: Surface Mount; Packaging: Bulk; Min Operating Temperature: -20°C; Manufacturer Part Number: RFM95W-868S2
FD1-FD6 = CMP-00028-00005-2: Fiducial - Round 1x2mm; Pins: 0
HL1 = CMP-007-00037-1: WURTH ELEKTRONIK - 150060GS75000 - LED, Green, 520 nm, 3.2 V, 30 mA, 430 mcd RoHS Compliant: Yes; Manufacturer: Würth Elektronik; Dominant Wavelength: 520nm; Forward Current: 30mA; Forward Voltage: 3.2V; Test Current: 20mA; Viewing Angle: 140°; Lens Style: Clear,Rectangular; Luminous Intensity: 430mcd; RoHS Compliant: Yes; Manufacturer Part Number: 150060GS75000; Wavelength: 520nm; Width: 0.8mm; Mount: Surface Mount; REACH SVHC: Unknown; Package Quantity: 4000; Max Operating Temperature: 85°C; Colour: Green; Length: 1.6mm; Case Code (Metric): 1608; Height: 0.7mm; Lead Free: Lead Free; Min Operating Temperature: -40°C; Case Code (Imperial): 0603; Packaging: Tape and Reel; Case/Package: 0603
L2 L3 = CMP-006-00041-1: Ferrite Beads High Current Chip 470Ohm 25% 100MHz 1A 0.2Ohm DCR 0805 T/R; Manufacturer: Bourns Inc.; DC Resistance (DCR): 200mR; Number of Lines: 1; Case Code (Metric): 2012; Max Operating Temperature: 125°C; Package Quantity: 4000; Packaging: Tape and Reel; Min Operating Temperature: -55°C; Case/Package: 0805; Core Material: Ferrite; Height: 0.043inch; Tolerance: 25%; Max Current Rating: 1A; RoHS Compliant: Yes; Case Code (Imperial): 0805; Termination: SMD/SMT; Depth: 1.4mm; Series: MH; Width: 1.2mm; Manufacturer Part Number: MH2029-471Y; Mount: Surface Mount; Length: 0.079inch; Max DC Current: 1A
MPU1 = CMP-020-00016-10: 8-bit Microcontroller with 32 Kbytes of ISP Flash and USB Controller, 2.7 to 5.5 V, -40 to 85 degC, 44-Pin QFP, Tray; Manufacturer: Atmel; PWM Channels: 8; Density: 32KB; Max Supply Voltage: 5.5V; Min Supply Voltage: 2.7V; Ethernet Channels: 0; Max Clock Frequency: 16MHz; ADC Channels: 12; I/Os: 26; RAM Size: 2.5KB; Package Version: Rev. J, 02/2014; Interface: USART; Case/Package: TQFP; Package Reference: 44ML; RoHS Compliant: True; Packaging: Tray; Mounting Technology: SM; Package Quantity: 800; Max Operating Temperature: 85°C; Datasheet Version: Rev. 7766IS, 07/2015; Package URL: http://www.atmel.com/images/atmel-7766-8-bit-avr-atmega16u4-32u4_summary.pdf; Min Operating Temperature: -40°C; Datasheet URL: http://www.atmel.com/images/atmel-7766-8-bit-avr-atmega16u4-32u4_summary.pdf; Manufacturer URL: http://www.atmel.com/; Package Description: 44-Pin Thin Profile Plastic Quad Flat Papckage, Body 10 x 10 mm, Pitch 0.8 mm; Frequency: 16MHz; Pins: 44
R5 = CMP-009-00269-2: Res Thick Film 0603 4.7K Ohm 1% 1/10W 100ppm/C Molded SMD SMD Paper T/R; Manufacturer: Stackpole Electronics Inc; Temperature Coefficient: 100ppm/°C; Component Comment: 4.7k 100mW; Military Standard: Not; Resistor Type: Thick Film; Tolerance: 1%; Contact Plating: Tin,Matte; Max Power Dissipation: 100mW; Case/Package: 0603; Length: 1.55mm; Case Code (Imperial): 0603; Max Operating Temperature: 155°C; Depth: 0.8mm; Manufacturer Part Number: RMCF0603FT4K70; Series: RMCF; Radiation Hardening: No; Case Code (Metric): 1608; Min Operating Temperature: -55°C; Lead Free: Lead Free; Width: 0.031inch; Height: 0.022inch; Number of Terminations: 2; Features: Automotive AEC-Q200; Construction: Rectangular; Packaging: Tape and Reel; RoHS Compliant: Yes; Mount: Surface Mount
R6 = Resistor: Manufacturer: YAGEO; Model: RC0603FR-0747KL; HelpURL: https://www.digikey.com/en/products/detail/yageo/RC0603FR-0747KL/727253; ComponentKind: 0603 (1608 Metric); Value: 47k; Supplier 1: Digi-Key; Supplier Part Number 1: 311-47.0KHRCT-ND
R7 = CMP-009-00023-7: Chip Resistor, 100 KOhm, +/- 1%, 0.1 W, -55 to 155 degC, 0603 (1608 Metric); Voltage Rating: 50V; Pins: 2; Case/Package: 0603; RoHS Compliant: True; Min Operating Temperature: -55°C; Max Operating Temperature: 155°C; Tolerance: 1%; Mounting Technology: SM
R8 = Resistor: Manufacturer: YAGEO; Model: RC0603FR-07523KL; HelpURL: https://www.digikey.com/en/products/detail/yageo/RC0603FR-07523KL/727292; ComponentKind: 0603 (1608 Metric); Value: 523k; Supplier 1: Digi-Key; Supplier Part Number 1: 311-523KHRCT-ND
R9 = CMP-00079-1: 510 Ohms ±5% 0.1W, 1/10W Chip Resistor 0603 (1608 Metric) Automotive AEC-Q200 Thick Film; Manufacturer: Stackpole Electronics Inc; Temperature Coefficient: 200ppm/°C; Case Code (Metric): 1608; Packaging: Tape and Reel; Max Power Dissipation: 100mW; Resistor Type: Thick Film; Military Standard: Not; Features: Automotive AEC-Q200; Lead Free: Lead Free; Case/Package: 0603; Case Code (Imperial): 0603; Max Operating Temperature: 155°C; Construction: Rectangular; Number of Terminations: 2; Contact Plating: Tin,Matte; Radiation Hardening: No; Series: RMCF; Width: 0.031inch; Manufacturer Part Number: RMCF0603JT510R; Size Code: 0603; Depth: 0.8mm; Mount: Surface Mount; Height: 0.022inch; Tolerance: 5%; Length: 0.061inch; Min Operating Temperature: -55°C; RoHS Compliant: Yes
VD1 = Diod Zener: Manufacturer: Diodes Incorporated; ComponentKind: X1-DFN1006-2; Model: DESD3V3S1BL-7B; HelpURL: https://www.digikey.com/en/products/detail/diodes-incorporated/DESD3V3S1BL-7B/4567778; Supplier 1: Digi-Key; Supplier Part Number 1: DESD3V3S1BL-7BDICT-ND; ComponentLink1Description: HelpURL; ComponentLink1URL: https://www.digikey.com/en/products/detail/diodes-incorporated/DESD3V3S1BL-7B/4567778
X3 = 2-Connector: CONN PLUG HOUSING EP .156 2POS; Manufacturer: TE Connectivity AMP Connectors; Model: 1-1123722-2; HelpURL: https://www.digikey.com/en/products/detail/te-connectivity-amp-connectors/1-1123722-2/686666?s=N4IgTCBcDaIIwFo5zAZgOxjAiBdAvkA; ComponentKind: Housings Plug Natural; Supplier 1: Digi-Key; Supplier Part Number 1: A30501-ND
X4 = 2-Connector: CONN HEADER VERT 2POS 3.96MM; Manufacturer: TE Connectivity AMP Connectors; Model: 1-1123723-2; HelpURL: https://www.digikey.com/en/products/detail/te-connectivity-amp-connectors/1-1123723-2/686925; ComponentKind: Connector Header Through Hole; Supplier 1: Digi-Key; Supplier Part Number 1: A111830-ND
X5 = 14-Connector: CONN HEADER VERT 14POS 2.54MM; Manufacturer: Adam Tech; Model: PH2-14-UA; HelpURL: https://www.digikey.com/en/products/detail/adam-tech/PH2-14-UA/9830507; ComponentKind: Through Hole 14 position; Supplier 1: Digi-Key; Supplier Part Number 1: 2057-PH2-14-UA-ND
XW3 = SMA: CONN SMA RCPT STR 50 OHM PCB; Manufacturer: Molex; Model: 0733910060; HelpURL: https://www.digikey.com/en/products/detail/molex/0733910060/1465165?s=N4IgTCBcDaIOwGYEE4CMBaADJgbJkAugL5A; ComponentKind: SMA Connector Receptacle; Supplier 1: Digi-Key; Supplier Part Number 1: WM5543-ND
XW4 = SMA: as XW1 on sheet Схема питания и GPS Peggy Tracker; HelpURL: https://www.digikey.com/en/products/detail/molex/0732512120/1465158?s=N4IgTCBcDaIOwGYwFYCMBaMqwAYQF0BfIA; ComponentKind: Board Edge; Supplier 1: Digi-Key; Supplier Part Number 1: WM5536-ND
ZQ1 = CMP-003-00033-4: Crystal 8MHz ±30ppm (Tol) ±30ppm (Stability) 18pF FUND 100Ohm 4-Pin SMD T/R; Manufacturer: Diodes Incorporated; ESR (Equivalent Series Resistance): 100R; Manufacturer Part Number: FY0800018; Frequency Stability: 30ppm; Frequency Tolerance: 30ppm; Load Capacitance: 18pF; Packaging: Cut Tape; Mount: Surface Mount; Max Operating Temperature: 85°C; Min Operating Temperature: -40°C; Height: 0.043inch; Case/Package: SMD/SMT; Width: 0.126inch; Length: 0.197inch
ZQ2 = Oscillator: Manufacturer: Abracon LLC; Model: ABS07-32.768KHZ-T; HelpURL: https://www.digikey.com/en/products/detail/abracon-llc/ABS07-32-768KHZ-T/1236858; ComponentKind: 2-SMD; Value: 32.7680KHZ; Supplier 1: Digi-Key; Supplier Part Number 1: 535-9542-1-ND

## Nets that join several sheets
3.3V: Схема питания и GPS Peggy Tracker (10 pins), Схема блока МК Peggy Tracker (C15.1 L2.2 L3.1)
3V_BAT: Схема питания и GPS Peggy Tracker (DD1.6 X2.1), Схема блока МК Peggy Tracker (D2.3)
GND: Схема питания и GPS Peggy Tracker (24 pins), Схема блока МК Peggy Tracker (35 pins)
VBAT: Схема питания и GPS Peggy Tracker (7 pins), Схема блока МК Peggy Tracker (R6.2)
GPS_RST: Схема питания и GPS Peggy Tracker (DD1.9), Схема блока МК Peggy Tracker (MPU1.26)
GPS_RX: Схема питания и GPS Peggy Tracker (DD1.3), Схема блока МК Peggy Tracker (MPU1.21)
GPS_TX: Схема питания и GPS Peggy Tracker (DD1.2), Схема блока МК Peggy Tracker (MPU1.20)
NetDD1_5: Схема питания и GPS Peggy Tracker (DD1.5), Схема блока МК Peggy Tracker (MPU1.22)

## Assembly variants
Variant of Peggy: not fitted ADC2 ADC3 ADC4 BOOT GPS_RST I2C_SCL I2C_SDA NOBOOT PA0 PA1 PA8 PA9 PB12 R3 SPI1_CLK SPI1_CS SPI1_SI SPI1_SO UART1_RX UART1_TX VBAT_ADC X2 X2 XP1